# Altium schematic sheet USBFX2LP_3.SchDoc: USBFX-3
size A; Revision: 04
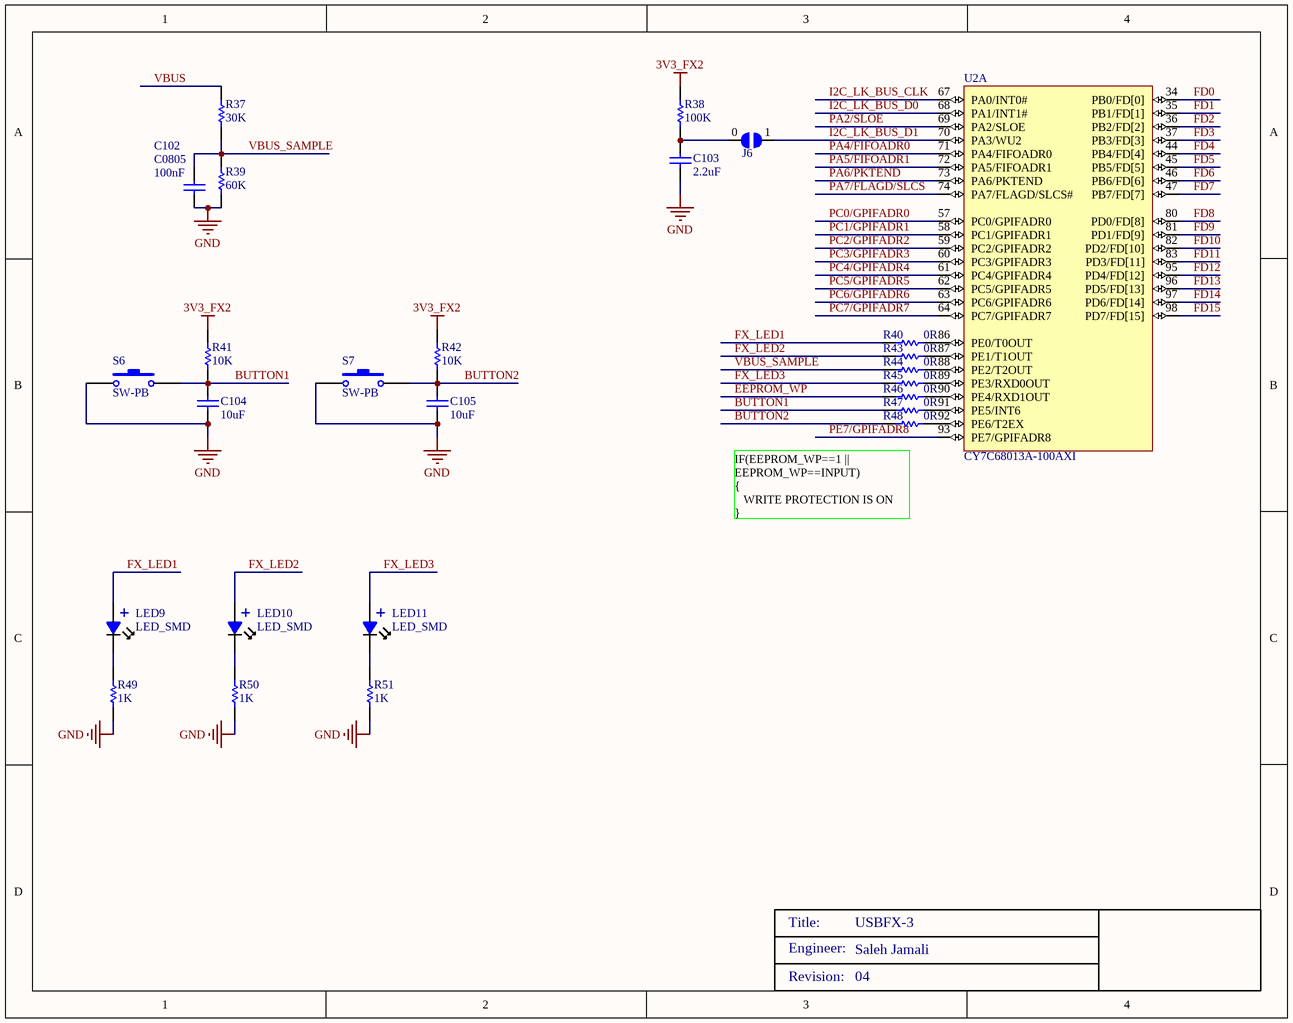
[diagram p0: USBFX2LP_3.SchDoc]

## Parts
C102  C0805  value 100nF  [0805]
C103  value 2.2uF  [0805]  (hidden comment: C0805)
C104  value 10uF  [0805]  (hidden comment: C0805)
C105  value 10uF  [0805]  (hidden comment: C0805)
J6  jumper  [jumper_pcb]  (value not drawn)
LED9  LED_SMD  [LED_805]
LED10  LED_SMD  [LED_805]
LED11  LED_SMD  [LED_805]
R37  30K  [ERA-0805]
R38  100K  [ERA-0805]
R39  60K  [ERA-0805]
R40  0R  [ERA-0805]
R41  10K  [ERA-0805]
R42  10K  [ERA-0805]
R43  0R  [ERA-0805]
R44  0R  [ERA-0805]
R45  0R  [ERA-0805]
R46  0R  [ERA-0805]
R47  0R  [ERA-0805]
R48  0R  [ERA-0805]
R49  1K  [ERA-0805]
R50  1K  [ERA-0805]
R51  1K  [ERA-0805]
S6  SW-PB  [SPST-2]
S7  SW-PB  [SPST-2]
U2  CY7C68013A-100AXI  [CYP-AX100RA_N]  (part A of 3)

## Nets
3V3_FX2: R38.1 R41.1 R42.1
GND: C102.1 C103.1 C104.1 C105.1 R39.2 R49.1 R50.1 R51.1 S6.1 S7.1
BUTTON1: C104.2 R41.2 R47.1 S6.2
BUTTON2: C105.2 R42.2 R48.1 S7.2
EEPROM_WP: R46.1
FD0: U2.34(PB0/FD[0])
FD1: U2.35(PB1/FD[1])
FD2: U2.36(PB2/FD[2])
FD3: U2.37(PB3/FD[3])
FD4: U2.44(PB4/FD[4])
FD5: U2.45(PB5/FD[5])
FD6: U2.46(PB6/FD[6])
FD7: U2.47(PB7/FD[7])
FD8: U2.80(PD0/FD[8])
FD9: U2.81(PD1/FD[9])
FD10: U2.82(PD2/FD[10])
FD11: U2.83(PD3/FD[11])
FD12: U2.95(PD4/FD[12])
FD13: U2.96(PD5/FD[13])
FD14: U2.97(PD6/FD[14])
FD15: U2.98(PD7/FD[15])
FX_LED1: LED9.1 R40.1
FX_LED2: LED10.1 R43.1
FX_LED3: LED11.1 R45.1
I2C_LK_BUS_CLK: U2.67(PA0/INT0#)
I2C_LK_BUS_D0: U2.68(PA1/INT1#)
I2C_LK_BUS_D1: J6.1 U2.70(PA3/WU2)
PA2/SLOE: U2.69(PA2/SLOE)
PA4/FIFOADR0: U2.71(PA4/FIFOADR0)
PA5/FIFOADR1: U2.72(PA5/FIFOADR1)
PA6/PKTEND: U2.73(PA6/PKTEND)
PA7/FLAGD/SLCS: U2.74(PA7/FLAGD/SLCS#)
PC0/GPIFADR0: U2.57(PC0/GPIFADR0)
PC1/GPIFADR1: U2.58(PC1/GPIFADR1)
PC2/GPIFADR2: U2.59(PC2/GPIFADR2)
PC3/GPIFADR3: U2.60(PC3/GPIFADR3)
PC4/GPIFADR4: U2.61(PC4/GPIFADR4)
PC5/GPIFADR5: U2.62(PC5/GPIFADR5)
PC6/GPIFADR6: U2.63(PC6/GPIFADR6)
PC7/GPIFADR7: U2.64(PC7/GPIFADR7)
PE7/GPIFADR8: U2.93(PE7/GPIFADR8)
VBUS: R37.1
VBUS_SAMPLE: C102.2 R37.2 R39.1 R44.1
NetC103_2: C103.2 J6.0 R38.2
NetLED9_2: LED9.2 R49.2
NetLED10_2: LED10.2 R50.2
NetLED11_2: LED11.2 R51.2
NetR40_2: R40.2 U2.86(PE0/T0OUT)
NetR43_2: R43.2 U2.87(PE1/T1OUT)
NetR44_2: R44.2 U2.88(PE2/T2OUT)
NetR45_2: R45.2 U2.89(PE3/RXD0OUT)
NetR46_2: R46.2 U2.90(PE4/RXD1OUT)
NetR47_2: R47.2 U2.91(PE5/INT6)
NetR48_2: R48.2 U2.92(PE6/T2EX)

## Notes on the sheet
- IF(EEPROM_WP==1 || EEPROM_WP==INPUT)
  {
  WRITE PROTECTION IS ON
  }
- Engineer:
- Title:
- Saleh Jamali
- Revision:

## Library data of the parts
C102-C105 = C0805: Ceramic Chip Capacitor - Standard; Note: Footprint corresponds to dimensions for bulk cassette packaging. This case size has tightened tolerances.; Published: 17-Jul-2002; LatestRevisionDate: 19-Mar-2004; LatestRevisionNote: Silkscreen size reduced.; DatasheetDocument: Mar-2001; PackageDocument: Mar-2001; PackageReference: 0805; Publisher: Altium Limited; Code_JEITA: 0805; Code_IPC: 2012[0805]; ComponentLink1Description: Manufacturer Link; ComponentLink1URL: http://www.kemet.com/; ComponentLink2Description: Datasheet; ComponentLink2URL: http://www.kemet.com/kemet/web/homepage/kechome.nsf/vapubfilesname/F3102TA.pdf/$file/F3102TA.pdf
R37-R51 = ERA6Y: Rectangular Thick Film Chip Resistor, 10 Ohm to 1M Ohm Range, 0.1% and 0.5% Tolerance, 0805 Size, 0.1 W; Note: If flow soldering, adjust pad width of PCB Footprint to 0.7 - 0.8 times the width of the resistor.; Published: 17-Dec-2003; LatestRevisionDate: 19-Mar-2004; LatestRevisionNote: Silkscreen size reduced.; PackageDocument: Mar-2003; PackageReference: ERA-0805; Publisher: Altium Limited; Code_IPC: 2012 [0805]; ComponentLink1Description: Manufacturer Link; ComponentLink1URL: http://www.panasonic.com/industrial/components/resistive_products.htm; ComponentLink2Description: Datasheet; ComponentLink2URL: http://www.panasonic.com/industrial/components/pdf/AOA0000CE8.pdf
S6 S7 = SW-PB: Switch; Published: 24-Mar-1999; LatestRevisionDate: 17-Jul-2002; LatestRevisionNote: Re-released for DXP Platform.; PackageReference: SPST-2; Publisher: Altium Limited; PackageDescription: Switch; 2 Leads
U2 = CY7C68013A-100AXI: EZ-USB(R) FX2LP(TM) USB Microcontroller High-Speed USB Peripheral Controller, 16 KB, 40 I/Os, 3 to 3.6 V, -40 to 85 degC, 100-Pin TQFP (AX100RA), Tray; Manufacturer: Cypress; Max. Operating Voltage (V): 3.6; Memory Architecture: RAM; Memory Size (KB): 16; Min. Operating Voltage (V): 3; No. of I/Os: 40; DatasheetVersion: Rev. *W; PackageVersion: Rev. *E; PackageReference: AX100RA; PackageDescription: 100-Pin Thin Quad Flat Pack, Body 14 x 20 mm, Pitch 0.65 mm; Supplier 1: Digi-Key; Supplier Part Number 1: 428-2263-ND; Supplier 2: Farnell; Supplier Part Number 2: 1876347; Supplier 3: Newark; Supplier Part Number 3: 19M7107; Supplier 4: Mouser; Supplier Part Number 4: 727-CYC68013A100AXI; CPU Core: Enhanced 8051; Max. Operating Temp. (degreesC): 85; Min. Operating Temp. (degreesC): -40; Packing: Tray; RoHS: Pb-Free; Mounting Technology: Surface Mount; Code_JEDEC: MS-026; PartNumber: CY7C68013A-100AXI; ComponentLink1Description: Manufacturer URL; ComponentLink1URL: http://www.cypress.com/; ComponentLink2Description: Datasheet; ComponentLink2URL: http://www.cypress.com/?docID=45142; ComponentLink3Description: Package Specification; ComponentLink3URL: http://www.cypress.com/?docID=48215